# EAGLE schematic Headlights (EAGLE 7.6.0)
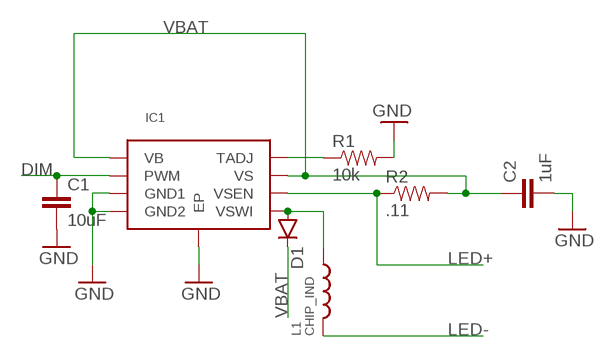
[diagram p0: schematic, sheet 1]

## Parts
C1  10uF  10UF10V10%(0805)  [0805-CAP]
C2  1uF  2.2UF50V10%(1206)  [1206-CAP]
D1  DIODESMA-ALT  [SMA-DIODE_ALT]
IC1  ILD6150_LED_DRIVER  [PG-DSO-8-27]
L1  CHIP_IND  [12X12MM_IND]
R1  10k  0.3OHM-1/8W-1%(0805)  [0805]
R2  .11  0.11OHM1/2W1%(2010)  [R2010]

## Nets
DIM: C1.1 IC1.P$2(PWM)
GND: C1.2 C2.2 IC1.P$3(GND1) IC1.P$4(GND2) IC1.P$9(EP) R1.2
LED+: IC1.P$6(VSEN) R2.1
LED-: L1.P$1
N$1: IC1.P$8(TADJ) R1.1
N$5: D1.A IC1.P$5(VSWI) L1.P$2
VBAT: C2.1 D1.C IC1.P$1(VB) IC1.P$7(VS) R2.2

## Library data of the parts
C1 = SparkFun-Capacitors:10UF10V10%(0805): CAP-11330; PROD_ID: CAP-11330
C2 = SparkFun-Capacitors:2.2UF50V10%(1206): CAP-10009
D1 = SparkFun-DiscreteSemi:DIODE: Diode These are standard reverse protection diodes and small signal diodes. SMA package can handle up to about 1A. SOD-323 can handle about 200mA. What the SOD-323 package when ordering, there are some mfgs out there that are 5-pin packages.
IC1 = lolomolo:ILD6150_LED_DRIVER
L1 = lolomolo:CHIP_IND: Chip Inductor
R1 = SparkFun-Resistors:0.3OHM-1/8W-1%(0805): RES-11622; PROD_ID: RES-11622; VALUE: 0.3
R2 = SparkFun-Resistors:0.11OHM1/2W1%(2010): RES-08354; PROD_ID: RES-08354